# EAGLE design quantizer2_v30 (EAGLE 9.6.2)

## Sheet 1 of 2
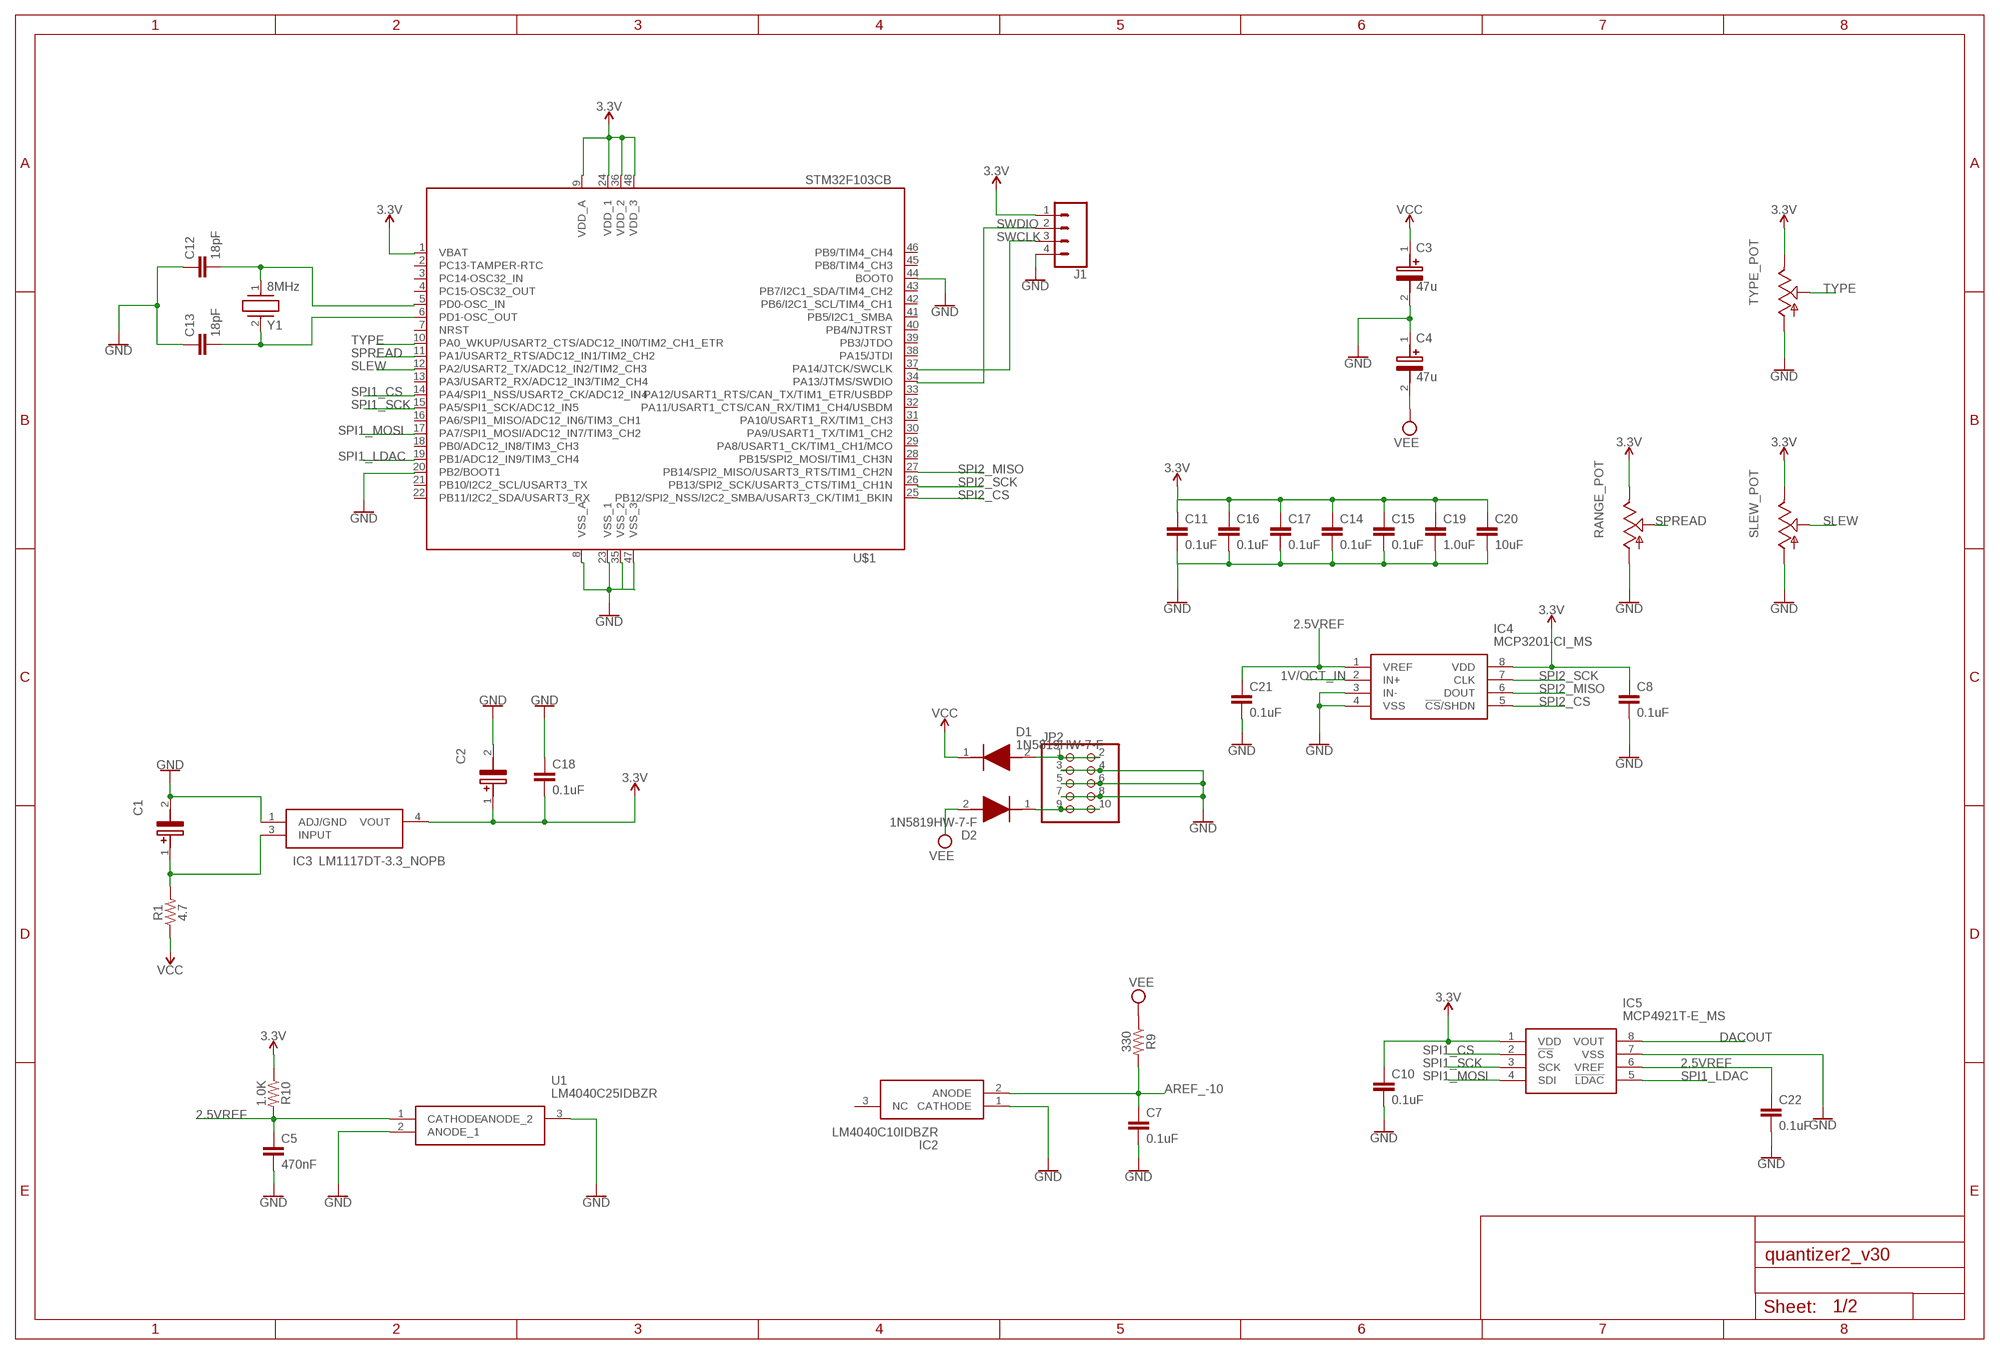
[diagram p0: schematic, sheet 1]

### Parts
C1  22uF  EEE-FP1E220AR  [EEE0GA101SR]
C2  22uF  EEE-FP1E220AR  [EEE0GA101SR]
C3  47u  EEE-FK1V470P  [EEE1AA101SP]
C4  47u  EEE-FK1V470P  [EEE1AA101SP]
C5  470nF  0.1UF-0603-25V-(+80/-20%)  [0603]
C7  0.1uF  0.1UF-0603-25V-(+80/-20%)  [0603]
C8  0.1uF  0.1UF-0603-25V-5%  [0603]
C10  0.1uF  0.1UF-0603-25V-5%  [0603]
C11  0.1uF  0.1UF-0603-25V-5%  [0603]
C12  18pF  18PF-0603-50V-5%  [0603]
C13  18pF  18PF-0603-50V-5%  [0603]
C14  0.1uF  0.1UF-0603-25V-5%  [0603]
C15  0.1uF  0.1UF-0603-25V-5%  [0603]
C16  0.1uF  0.1UF-0603-25V-(+80/-20%)  [0603]
C17  0.1uF  0.1UF-0603-25V-(+80/-20%)  [0603]
C18  0.1uF  0.1UF-0603-25V-(+80/-20%)  [0603]
C19  1.0uF  1.0UF-0603-16V-10%  [0603]
C20  10uF  10UF-0603-6.3V-20%  [0603]
C21  0.1uF  0.1UF-0603-25V-5%  [0603]
C22  0.1uF  0.1UF-0603-25V-5%  [0603]
D1  1N5819HW-7-F  [SOD3716X145N]
D2  1N5819HW-7-F  [SOD3716X145N]
IC2  LM4040C10IDBZR  [SOT95P237X112-3N]
IC3  LM1117DT-3.3_NOPB  [TO228P991X238-3N]
IC4  MCP3201-CI_MS  [SOP65P490X110-8N]
IC5  MCP4921T-E_MS  [SOP65P490X110-8N]
J1  CONN_04  [1X04]
JP2  PINHD-2X5  [2X05]
R1  4.7  RESISTOR1206  [1206]
R9  330  RESISTOR0603  [0603]
R10  1.0K  RESISTOR0603  [0603]
RANGE_POT  POT_USVERTICAL_PS  [ALPS_POT_VERTICAL_PS]
SLEW_POT  POTENTIOMETER-ALPHA-9MM_VERTICAL_  [POTENTIOMETER-ALPHA-9MM_VERTICAL]
TYPE_POT  POT_USVERTICAL_PS  [ALPS_POT_VERTICAL_PS]
U1  LM4040C25IDBZR  [SOT95P237X112-3N]
U$1  STM32F103CB  [LQFP48]
Y1  8MHz  ABLS3-8.000MHZ-D4Y-T  [ABLS]

### Nets
1V/OCT_IN: IC4.2(IN+) ; also sheet 2
2.5VREF: C5.1 C21.1 C22.1 IC4.1(VREF) IC5.6(VREF) R10.2 U1.1(CATHODE)
3.3V: C2.1(+) C8.1 C10.1 C11.1 C14.1 C15.1 C16.1 C17.1 C18.2 C19.1 C20.1 IC3.4(VOUT) IC4.8(VDD) IC5.1(VDD) J1.1 R10.1 RANGE_POT.P$1(E) SLEW_POT.3(E) TYPE_POT.P$1(E) U$1.1(VBAT) U$1.9(VDD_A) U$1.24(VDD_1) U$1.36(VDD_2) U$1.48(VDD_3)
AREF_-10: C7.1 IC2.2(ANODE) R9.2 ; also sheet 2
DACOUT: IC5.8(VOUT) ; also sheet 2
GND: C1.2(-) C2.2(-) C3.2(-) C4.1(+) C5.2 C7.2 C8.2 C10.2 C12.1 C13.1 C18.1 C21.2 C22.2 IC2.1(CATHODE) IC3.1(ADJ/GND) IC4.3(IN-) IC4.4(VSS) IC5.7(VSS) J1.4 JP2.3 JP2.4 JP2.5 JP2.6 JP2.7 JP2.8 RANGE_POT.P$3(A) SLEW_POT.1(A) TYPE_POT.P$3(A) U1.2(ANODE_1) U1.3(ANODE_2) U$1.8(VSS_A) U$1.20(PB2/BOOT1) U$1.23(VSS_1) U$1.35(VSS_2) U$1.44(BOOT0) U$1.47(VSS_3) ; also sheet 2
N$2: C1.1(+) IC3.3(INPUT) R1.2
N$4: D1.2(A) JP2.1 JP2.2
N$6: D2.1(K) JP2.9 JP2.10
N$10: C12.2 U$1.5(PD0-OSC_IN) Y1.1
N$11: C13.2 U$1.6(PD1-OSC_OUT) Y1.2
N$12: C11.2 C14.2 C15.2 C16.2 C17.2 C19.2 C20.2 ; supply symbol labelled GND
SLEW: SLEW_POT.2(S) U$1.12(PA2/USART2_TX/ADC12_IN2/TIM2_CH3)
SPI1_CS: IC5.2(!CS) U$1.14(PA4/SPI1_NSS/USART2_CK/ADC12_IN4)
SPI1_LDAC: IC5.5(!LDAC) U$1.19(PB1/ADC12_IN9/TIM3_CH4)
SPI1_MOSI: IC5.4(SDI) U$1.17(PA7/SPI1_MOSI/ADC12_IN7/TIM3_CH2)
SPI1_SCK: IC5.3(SCK) U$1.15(PA5/SPI1_SCK/ADC12_IN5)
SPI2_CS: IC4.5(!CS!/SHDN) U$1.25(PB12/SPI2_NSS/I2C2_SMBA/USART3_CK/TIM1_BKIN)
SPI2_MISO: IC4.6(DOUT) U$1.27(PB14/SPI2_MISO/USART3_RTS/TIM1_CH2N)
SPI2_SCK: IC4.7(CLK) U$1.26(PB13/SPI2_SCK/USART3_CTS/TIM1_CH1N)
SPREAD: RANGE_POT.P$2(S) U$1.11(PA1/USART2_RTS/ADC12_IN1/TIM2_CH2)
SWCLK: J1.3 U$1.37(PA14/JTCK/SWCLK)
SWDIO: J1.2 U$1.34(PA13/JTMS/SWDIO)
TYPE: TYPE_POT.P$2(S) U$1.10(PA0_WKUP/USART2_CTS/ADC12_IN0/TIM2_CH1_ETR)
VCC: C3.1(+) D1.1(K) R1.1 ; also sheet 2
VEE: C4.2(-) D2.2(A) R9.1 ; also sheet 2
Unconnected: IC2.3(NC) U$1.2(PC13-TAMPER-RTC) U$1.3(PC14-OSC32_IN) U$1.4(PC15-OSC32_OUT) U$1.7(NRST) U$1.13(PA3/USART2_RX/ADC12_IN3/TIM2_CH4) U$1.16(PA6/SPI1_MISO/ADC12_IN6/TIM3_CH1) U$1.18(PB0/ADC12_IN8/TIM3_CH3) U$1.21(PB10/I2C2_SCL/USART3_TX) U$1.22(PB11/I2C2_SDA/USART3_RX) U$1.28(PB15/SPI2_MOSI/TIM1_CH3N) U$1.29(PA8/USART1_CK/TIM1_CH1/MCO) U$1.30(PA9/USART1_TX/TIM1_CH2) U$1.31(PA10/USART1_RX/TIM1_CH3) U$1.32(PA11/USART1_CTS/CAN_RX/TIM1_CH4/USBDM) U$1.33(PA12/USART1_RTS/CAN_TX/TIM1_ETR/USBDP) U$1.38(PA15/JTDI) U$1.39(PB3/JTDO) U$1.40(PB4/NJTRST) U$1.41(PB5/I2C1_SMBA) U$1.42(PB6/I2C1_SCL/TIM4_CH1) U$1.43(PB7/I2C1_SDA/TIM4_CH2) U$1.45(PB8/TIM4_CH3) U$1.46(PB9/TIM4_CH4)

## Sheet 2 of 2
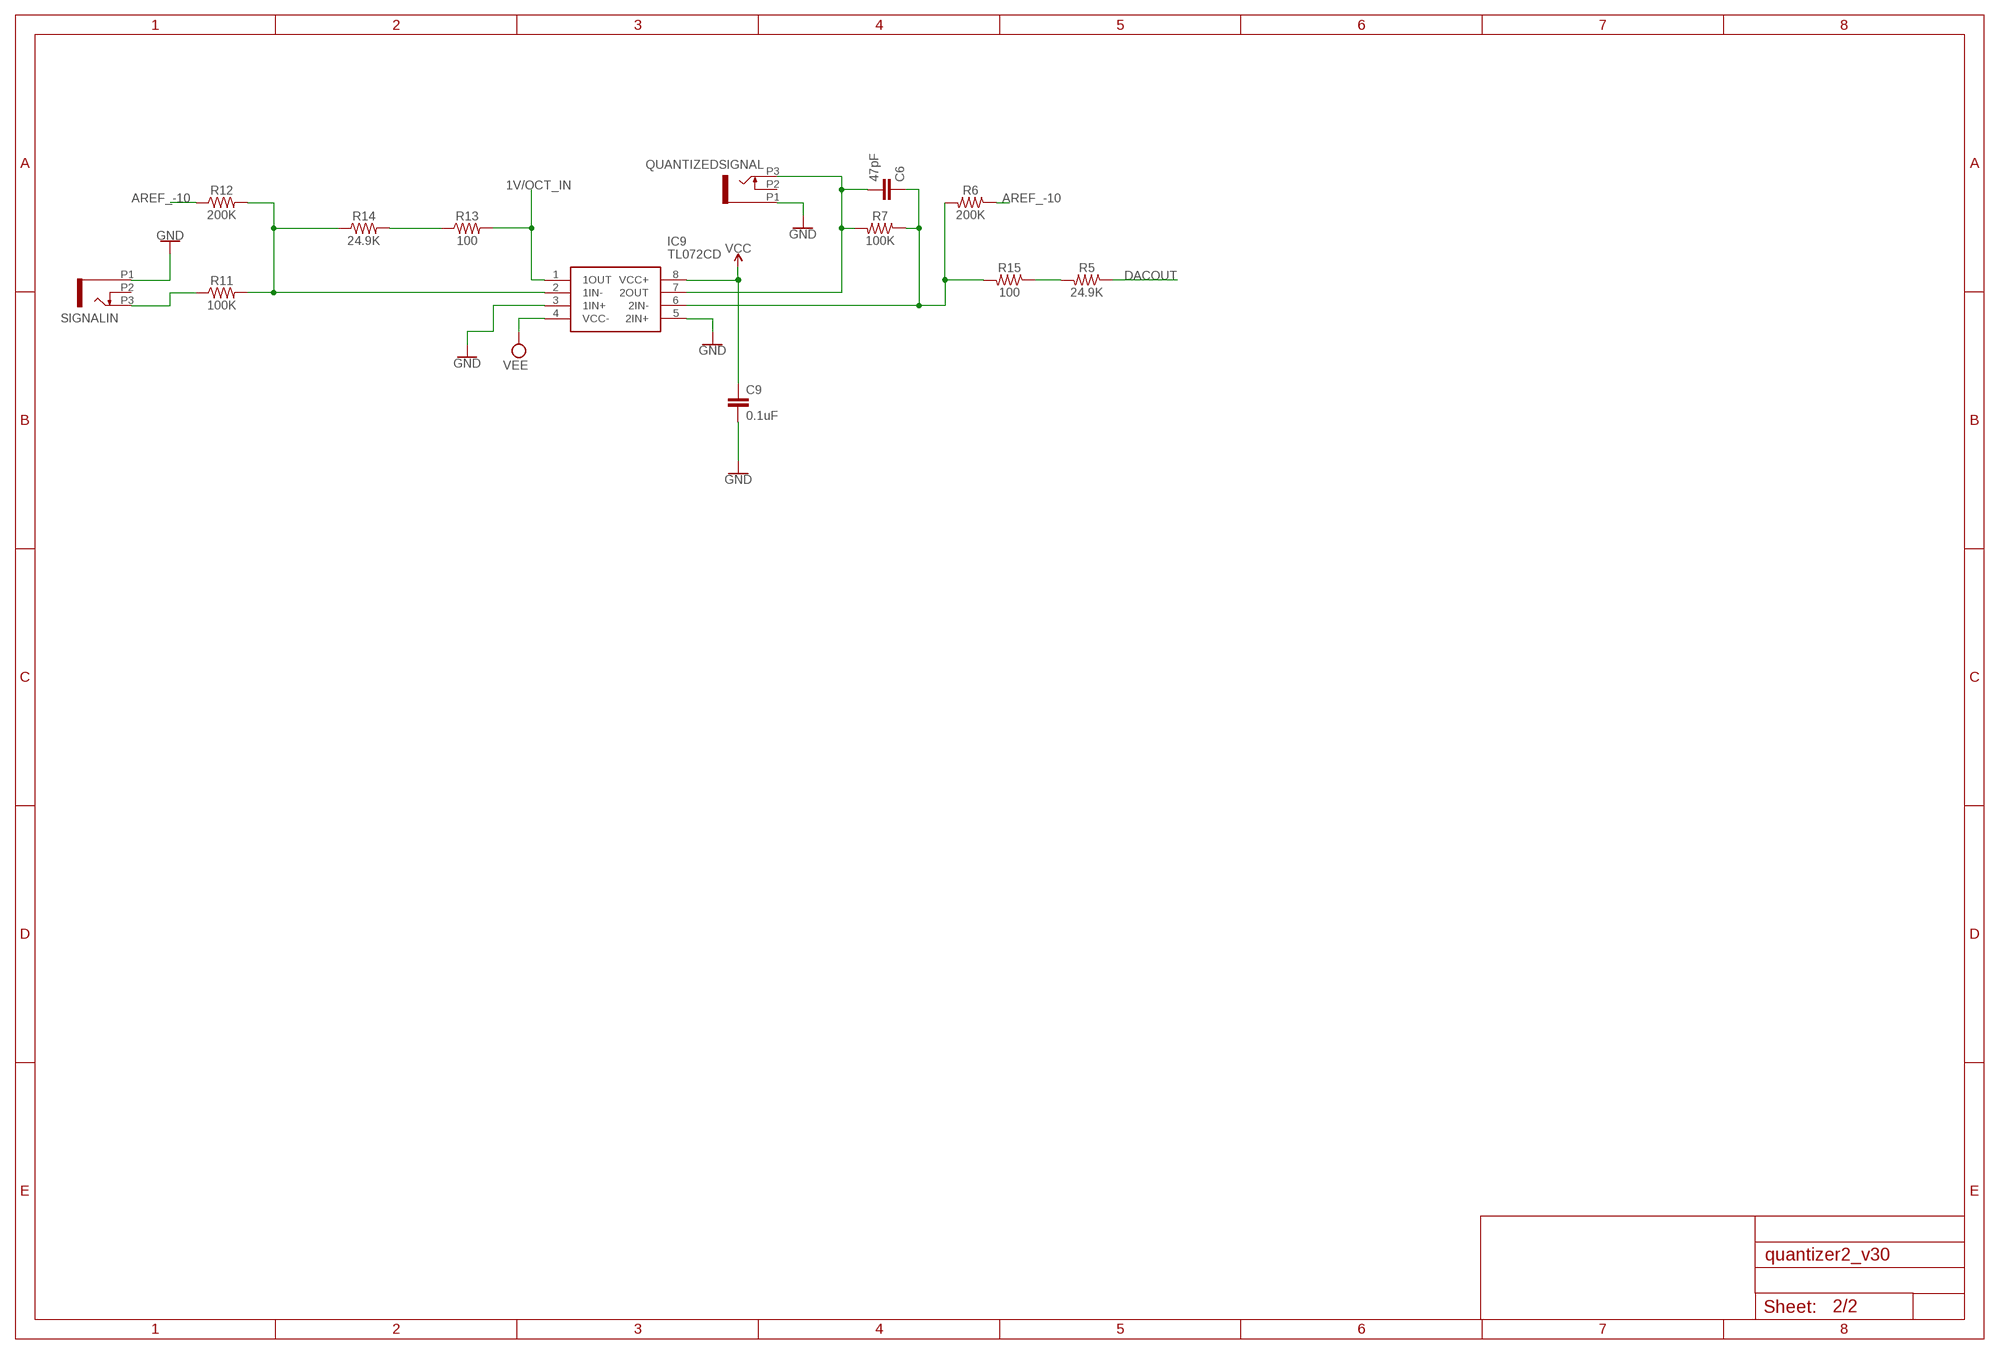
[diagram p1: schematic, sheet 2]

### Parts
C6  47pF  0.1UF-0603-25V-(+80/-20%)  [0603]
C9  0.1uF  0.1UF-0603-25V-(+80/-20%)  [0603]
IC9  TL072CD  [SOIC127P600X175-8N]
QUANTIZEDSIGNAL  PJ301_THONKICONN6  [WQP_PJ_301M6]
R5  24.9K  RESISTOR0603  [0603]
R6  200K  RESISTOR0603  [0603]
R7  100K  RESISTOR0603  [0603]
R11  100K  RESISTOR0603  [0603]
R12  200K  RESISTOR0603  [0603]
R13  100  RESISTOR0603  [0603]
R14  24.9K  RESISTOR0603  [0603]
R15  100  RESISTOR0603  [0603]
SIGNALIN  PJ301_THONKICONN6  [WQP_PJ_301M6]

### Nets
1V/OCT_IN: IC9.1(1OUT) R13.2 ; also sheet 1
AREF_-10: R6.1 R12.1 ; also sheet 1
DACOUT: R5.1 ; also sheet 1
GND: C9.2 IC9.3(1IN+) IC9.5(2IN+) QUANTIZEDSIGNAL.P1 SIGNALIN.P1 ; also sheet 1
N$5: R11.1 SIGNALIN.P3
N$8: IC9.2(1IN-) R11.2 R12.2 R14.1
N$13: C6.2 IC9.7(2OUT) QUANTIZEDSIGNAL.P3 R7.2
N$15: R13.1 R14.2
N$16: R5.2 R15.1
N$17: C6.1 IC9.6(2IN-) R6.2 R7.1 R15.2
VCC: C9.1 IC9.8(VCC+) ; also sheet 1
VEE: IC9.4(VCC-) ; also sheet 1
Unconnected: QUANTIZEDSIGNAL.P2 SIGNALIN.P2

## Library data of the parts
C1 C2 = EEE-FP1E220AR:EEE-FP1E220AR: PANASONIC - EEEFP1E220AR - SMD Aluminium Electrolytic Capacitor, Radial Can - SMD, 22 F, 25 V, 0.36 ohm, FP Series Source: Datasheet <http://industrial.panasonic.com/cdbs/www-data/pdf/RDE0000/ABA0000C1184.pdf>; DESCRIPTION: PANASONIC - EEEFP1E220AR - SMD Aluminium Electrolytic Capacitor, Radial Can - SMD, 22 F, 25 V, 0.36 ohm, FP Series; HEIGHT: 6.5mm; MANUFACTURER_NAME: Panasonic; MANUFACTURER_PART_NUMBER: EEE-FP1E220AR; MOUSER_PART_NUMBER: 667-EEE-FP1E220AR; MOUSER_PRICE-STOCK: https://www.mouser.co.uk/ProductDetail/Panasonic/EEE-FP1E220AR?qs=d1CqaRUMZD%252ByxlCLn0gmaw%3D%3D
C3 C4 = EEE-FK1V470P:EEE-FK1V470P: Aluminum Electrolytic Capacitors - SMD 47uF 35V Source: Datasheet <http://industrial.panasonic.com/cdbs/www-data/pdf/RDE0000/ABA0000C1181.pdf>; DESCRIPTION: Aluminum Electrolytic Capacitors - SMD 47uF 35V; HEIGHT: 7.8mm; MANUFACTURER_NAME: Panasonic; MANUFACTURER_PART_NUMBER: EEE-FK1V470P; MOUSER_PART_NUMBER: 667-EEE-FK1V470P; MOUSER_PRICE-STOCK: https://www.mouser.co.uk/ProductDetail/Panasonic/EEE-FK1V470P?qs=qE6bgDGEOCuVUX5CkiabHQ%3D%3D
C5 C6 = SparkFun-Capacitors:0.1UF: 0.1µF ceramic capacitors A capacitor is a passive two-terminal electrical component used to store electrical energy temporarily in an electric field.; PROD_ID: CAP-00810; VALUE: 0.1uF
C7 C9 C16-C18 = SparkFun-Capacitors:0.1UF: 0.1µF ceramic capacitors A capacitor is a passive two-terminal electrical component used to store electrical energy temporarily in an electric field.; PROD_ID: CAP-00810
C8 C10 C11 C14 C15 C21 C22 = SparkFun-Capacitors:0.1UF: 0.1µF ceramic capacitors A capacitor is a passive two-terminal electrical component used to store electrical energy temporarily in an electric field.; PROD_ID: CAP-08604
C12 C13 = SparkFun-Capacitors:18PF: 18pF ceramic capacitors A capacitor is a passive two-terminal electrical component used to store electrical energy temporarily in an electric field.; PROD_ID: CAP-08267
C19 = SparkFun-Capacitors:1.0UF: 1µF ceramic capacitors A capacitor is a passive two-terminal electrical component used to store electrical energy temporarily in an electric field.; PROD_ID: CAP-00868
C20 = SparkFun-Capacitors:10UF: 10.0µF ceramic capacitors A capacitor is a passive two-terminal electrical component used to store electrical energy temporarily in an electric field.; PROD_ID: CAP-11015
D1 D2 = 1N5819HW-7-F:1N5819HW-7-F: Diode Schottky 1A 40V SOD123 Diodes Inc 1N5819HW-7-F, SMT Schottky Diode, 40V 1A, 2-Pin SOD-123 Source: Datasheet <https://datasheet.datasheetarchive.com/originals/distributors/Datasheets-DGA23/1390892.pdf>; DESCRIPTION: Diode Schottky 1A 40V SOD123 Diodes Inc 1N5819HW-7-F, SMT Schottky Diode, 40V 1A, 2-Pin SOD-123; HEIGHT: 1.45mm; MANUFACTURER_NAME: Diodes Inc.; MANUFACTURER_PART_NUMBER: 1N5819HW-7-F; MOUSER_PART_NUMBER: 621-1N5819HW-F; MOUSER_PRICE-STOCK: https://www.mouser.co.uk/ProductDetail/Diodes-Incorporated/1N5819HW-7-F?qs=NQ47qNm99eDyWTEd07miYA%3D%3D
IC2 = LM4040C10IDBZR:LM4040C10IDBZR: PRECISION MICROPOWER SHUNT VOLTAGE REFERENCE Source: Datasheet <http://www.ti.com/lit/gpn/lm4040>; DESCRIPTION: PRECISION MICROPOWER SHUNT VOLTAGE REFERENCE; HEIGHT: mm; MANUFACTURER_NAME: Texas Instruments; MANUFACTURER_PART_NUMBER: LM4040C10IDBZR; MOUSER_PART_NUMBER: 595-LM4040C10IDBZR; MOUSER_PRICE-STOCK: https://www.mouser.com/Search/Refine.aspx?Keyword=595-LM4040C10IDBZR
IC3 = LM1117DT-3.3_NOPB:LM1117DT-3.3_NOPB: Space saving 800-mA low-dropout linear regulator with internal current limit Source: Datasheet <https://datasheet.datasheetarchive.com/originals/distributors/Datasheets-SFU2/DSASFU100036103.pdf>; DESCRIPTION: Space saving 800-mA low-dropout linear regulator with internal current limit; HEIGHT: 2.38mm; MANUFACTURER_NAME: Texas Instruments; MANUFACTURER_PART_NUMBER: LM1117DT-3.3/NOPB; MOUSER_PART_NUMBER: 926-LM1117DT-3.3NOPB; MOUSER_PRICE-STOCK: https://www.mouser.co.uk/ProductDetail/Texas-Instruments/LM1117DT-3.3-NOPB?qs=X1J7HmVL2ZHOT670myqy2w%3D%3D
IC4 = MCP3201-CI_MS:MCP3201-CI_MS: Analog to Digital Converters - ADC 12-bit SPI Sgl Chl Source: Datasheet <http://www.microchip.com/mymicrochip/filehandler.aspx?ddocname=en011279>; DESCRIPTION: Analog to Digital Converters - ADC 12-bit SPI Sgl Chl; HEIGHT: 1.1mm; MANUFACTURER_NAME: Microchip; MANUFACTURER_PART_NUMBER: MCP3201-CI/MS; MOUSER_PART_NUMBER: 579-MCP3201-CI/MS; MOUSER_PRICE-STOCK: https://www.mouser.co.uk/ProductDetail/Microchip-Technology-Atmel/MCP3201-CI-MS?qs=mcPJWgAPNrdThuaOU%2FBAFA%3D%3D
IC5 = MCP4921T-E_MS:MCP4921T-E_MS: Digital to Analog Converters - DAC Sgl 12-bit SPI int Source: Datasheet <http://www.microchip.com/mymicrochip/filehandler.aspx?ddocname=en547911>; DESCRIPTION: Digital to Analog Converters - DAC Sgl 12-bit SPI int; HEIGHT: 1.1mm; MANUFACTURER_NAME: Microchip; MANUFACTURER_PART_NUMBER: MCP4921T-E/MS; MOUSER_PART_NUMBER: 579-MCP4921T-E/MS; MOUSER_PRICE-STOCK: https://www.mouser.co.uk/ProductDetail/Microchip-Technology/MCP4921T-E-MS?qs=fM4xO01eazMZI7WjXZqD2A%3D%3D
IC9 = TL072CD:TL072CD: Dual Low-Noise JFET-Input General-Purpose Operational Amplifier Source: Datasheet <http://www.ti.com/lit/ds/symlink/tl072.pdf>; DESCRIPTION: Dual Low-Noise JFET-Input General-Purpose Operational Amplifier; HEIGHT: 1.75mm; MANUFACTURER_NAME: Texas Instruments; MANUFACTURER_PART_NUMBER: TL072CD; MOUSER_PART_NUMBER: 595-TL072CD; MOUSER_PRICE-STOCK: https://www.mouser.co.uk/ProductDetail/Texas-Instruments/TL072CD?qs=5nGYs9Do7G0niDPig1J2Tw%3D%3D
J1 = SparkFun-Connectors:CONN_04: Multi connection point. Often used as Generic Header-pin footprint for 0.1 inch spaced/style header connections On any of the 0.1 inch spaced packages, you can populate with these: Break Away Headers - Straight <https://www.sparkfun.com/products/116> (PRT-00116) Break Away Male Headers - Right Angle <https://www.sparkfun.com/products/553> (PRT-00553) Female Headers <https://www.sparkfun.com/products/115> (PRT-00115) Break Away Headers - Machine Pin <https://www.sparkfun.com/products/117> (PRT-00117) Break Away Female Headers - Swiss Machine Pin <https://www.sparkfun.com/products/743> (PRT-00743) For SCREWTERMINALS and SPRING TERMINALS visit here: Screw Terimnals on SparkFun.com <https://www.sparkfun.com/search/results?term=Screw+Terminals> (5mm/3.5mm/2.54mm spacing) This device is also useful as a general connection point to wire up your design to another part of your project. Our various solder wires solder well into these plated through hole pads. Hook-Up Wire - Assortment (Stranded, 22 AWG) <https://www.sparkfun.com/products/11375> (PRT-11375) Hook-Up Wire - Assortment (Solid Core, 22 AWG) <https://www.sparkfun.com/products/11367> (PRT-11367) View the entire wire category on our website here <https://www.sparkfun.com/categories/141> Special notes: Molex polarized connector foot print use with SKU : PRT-08231 with associated crimp pins and housings. 1MM SMD Version SKU: PRT-10208; PROD_ID: CONN-09696
JP2 = pinhead:PINHD-2X5: PIN HEADER
QUANTIZEDSIGNAL SIGNALIN = og-pj301_variations:PJ301_THONKICONN
R1 R5-R7 R9-R15 = SparkFun-Resistors:RESISTOR: Generic Resistor Package
RANGE_POT TYPE_POT = og-pots:POT_US
SLEW_POT = EURACK-MASTER-LIB:POTENTIOMETER-ALPHA-9MM_VERTICAL: 9mm vertical snap-in pot, Alpha / Panasonic style
U1 = LM4040C25IDBZR:LM4040C25IDBZR: TEXAS INSTRUMENTS - LM4040C25IDBZR - VOLTAGE REF, SHUNT, 2.5V, SOT-23-3 Source: Datasheet <https://datasheet.datasheetarchive.com/originals/distributors/Datasheets-DGA16/867624.pdf>; DESCRIPTION: TEXAS INSTRUMENTS - LM4040C25IDBZR - VOLTAGE REF, SHUNT, 2.5V, SOT-23-3; HEIGHT: 1.12mm; MANUFACTURER_NAME: Texas Instruments; MANUFACTURER_PART_NUMBER: LM4040C25IDBZR; MOUSER_PART_NUMBER: 595-LM4040C25IDBZR; MOUSER_PRICE-STOCK: https://www.mouser.co.uk/ProductDetail/Texas-Instruments/LM4040C25IDBZR?qs=VBduBm9rCJStNYDGENjZXg%3D%3D
U$1 = stm32:STM32F103CB
Y1 = ABLS3-8.000MHZ-D4Y-T:ABLS3-8.000MHZ-D4Y-T: HC49/US (AT49) LOW PROFILE SMD MICROPROCESSOR CRYSTAL Source: Datasheet <https://abracon.com/Resonators/abls.pdf>; DESCRIPTION: HC49/US (AT49) LOW PROFILE SMD MICROPROCESSOR CRYSTAL; HEIGHT: mm; MANUFACTURER_NAME: ABRACON; MANUFACTURER_PART_NUMBER: ABLS3-8.000MHZ-D4Y-T; MOUSER_PART_NUMBER: 815-ABLS3-8MD4YT; MOUSER_PRICE-STOCK: https://www.mouser.co.uk/ProductDetail/ABRACON/ABLS3-8000MHZ-D4Y-T?qs=WRzgYYgs9gC3im7pazpFGA%3D%3D

## Board
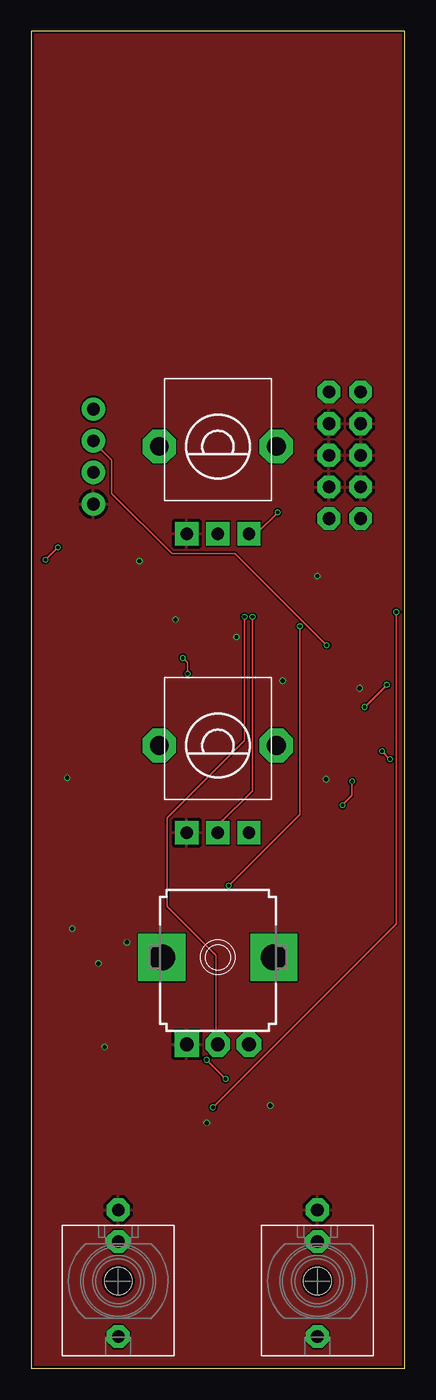
[diagram p2: board, top side]
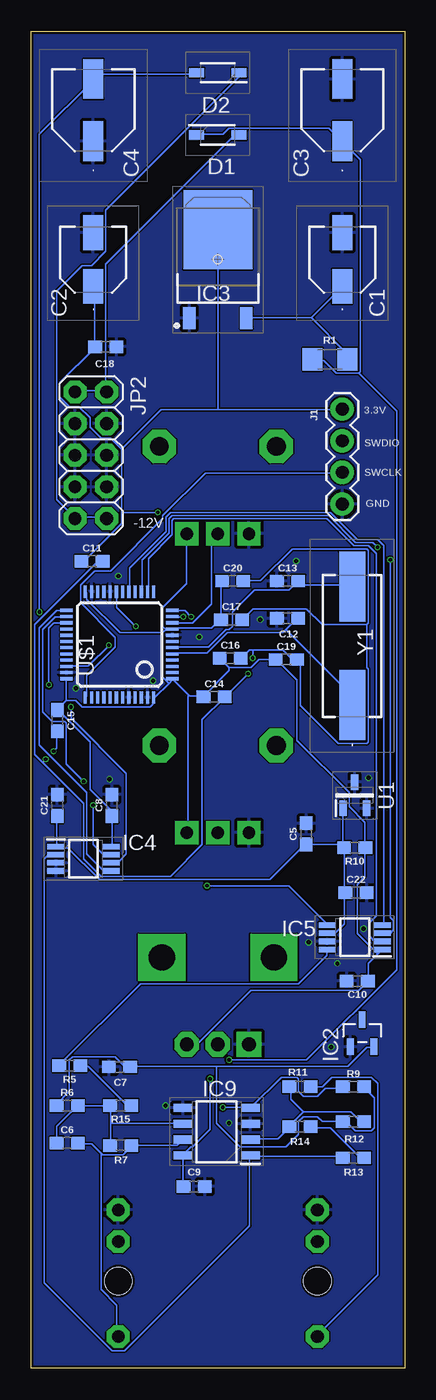
[diagram p3: board, bottom side, seen from below]

Size 30 x 107.34 mm. Coordinates in mm from the lower left corner, seen from the top.
Outline: 0,0 30,0 30,107.34 0,107.34 0,0
Copper layers (1*16): Top 0.035mm / dielectric 1.6mm / Bottom 0.035mm
Design rules "jlcpcb-2layers": minimum track width 5mil, minimum drill 0.3mm, track to track 5mil, track to pad 5mil, pad to pad 5mil, via to via 5mil, smd to smd 5mil, copper to edge 0.2mm, drill to drill 6mil, minimum pad ring 10mil, minimum via ring 3mil, stop-mask expansion 4mil, vias tented up to drill 0mil, thermal gap 10mil

### Footprints (pad centres in the part's own frame; a part is rotated, then mirrored left to right if it is on the bottom)
EEE0GA101SR = smd 2.8 x 1.6: 1 -2.15,0; 2 2.15,0
EEE1AA101SP = smd 3.2 x 1.6: 1 -2.5,0; 2 2.5,0
0603 = smd 1.1 x 1: 1 -0.85,0; 2 0.85,0
SOD3716X145N = smd 1.2 x 0.75: 1 -1.7,0; 2 1.7,0
SOT95P237X112-3N = smd 1.321 x 0.559: 1 -1.092,0.94; 2 -1.092,-0.94 | smd 1.321 x 0.508: 3 1.092,0
TO228P991X238-3N = smd 1.75 x 1: 1 -4.7,2.285; 3 -4.7,-2.285 | smd 6.35 x 5.55: 4 2.4,0
SOP65P490X110-8N = smd 1.4 x 0.45: 1 -2.2,0.975; 2 -2.2,0.325; 3 -2.2,-0.325; 4 -2.2,-0.975; 5 2.2,-0.975; 6 2.2,-0.325; 7 2.2,0.325; 8 2.2,0.975
SOIC127P600X175-8N = smd 1.528 x 0.65: 1 -2.711,1.905; 2 -2.711,0.635; 3 -2.711,-0.635; 4 -2.711,-1.905; 5 2.711,-1.905; 6 2.711,-0.635; 7 2.711,0.635; 8 2.711,1.905
1X04 = drill 1.016 pad 1.88: 1 0,0; 2 2.54,0; 3 5.08,0; 4 7.62,0
2X05 = drill 1.016 octagon: 1 -5.08,-1.27; 2 -5.08,1.27; 3 -2.54,-1.27; 4 -2.54,1.27; 5 0,-1.27; 6 0,1.27; 7 2.54,-1.27; 8 2.54,1.27; 9 5.08,-1.27; 10 5.08,1.27
WQP_PJ_301M6 = drill 1.016 pad 1.778 octagon: P1 0,-5.715; P2 0,-3.175; P3 0,4.445 | hole 2.2: 0,0
1206 = smd 1.6 x 1.8: 1 -1.4,0; 2 1.4,0
ALPS_POT_VERTICAL_PS = drill 1 pad 1.88 square: P$1 -2.5,7; P$2 0,7; P$3 2.5,7 | drill 1.5 pad 2.54 octagon: P$4 -4.7,0; P$5 4.7,0
POTENTIOMETER-ALPHA-9MM_VERTICAL = drill 1.1 pad 1.676 square: 1 -2.5,-7 | drill 1.1 pad 1.676 octagon: 2 0,-7; 3 2.5,-7 | drill 2.1 pad 2.8 square: M1 4.5,0; M2 -4.5,0
SOT95P237X112-3N' = smd 1.25 x 0.6: 1 -1.05,0.95; 2 -1.05,-0.95; 3 1.05,0
LQFP48 = smd 0.254 x 1: 1 -2.75,-4.25; 2 -2.25,-4.25; 3 -1.75,-4.25; 4 -1.25,-4.25; 5 -0.75,-4.25; 6 -0.25,-4.25; 7 0.25,-4.25; 8 0.75,-4.25; 9 1.25,-4.25; 10 1.75,-4.25; 11 2.25,-4.25; 12 2.75,-4.25; 25 2.75,4.25; 26 2.25,4.25; 27 1.75,4.25; 28 1.25,4.25; 29 0.75,4.25; 30 0.25,4.25; 31 -0.25,4.25; 32 -0.75,4.25; 33 -1.25,4.25; 34 -1.75,4.25; 35 -2.25,4.25; 36 -2.75,4.25 | smd 1 x 0.254: 13 4.25,-2.75; 14 4.25,-2.25; 15 4.25,-1.75; 16 4.25,-1.25; 17 4.25,-0.75; 18 4.25,-0.25; 19 4.25,0.25; 20 4.25,0.75; 21 4.25,1.25; 22 4.25,1.75; 23 4.25,2.25; 24 4.25,2.75; 37 -4.25,2.75; 38 -4.25,2.25; 39 -4.25,1.75; 40 -4.25,1.25; 41 -4.25,0.75; 42 -4.25,0.25; 43 -4.25,-0.25; 44 -4.25,-0.75; 45 -4.25,-1.25; 46 -4.25,-1.75; 47 -4.25,-2.25; 48 -4.25,-2.75
ABLS = smd 5.6 x 2.1: 1 -4.75,0; 2 4.75,0

### Placement (x,y rotation side)
C1  5,89 90 bottom
C2  25,89 90 bottom
C3  5,101 90 bottom
C4  25,101 90 bottom
C5  7.9,42.9 90 bottom
C6  27.1,18.1 0 bottom
C7  22.9,24.2 180 bottom
C8  23.5,45.2 90 bottom
C9  16.9,14.6 0 bottom
C10  3.8,31.1 180 bottom
C11  25.1,64.8 0 bottom
C12  9.4,60.2 0 bottom
C13  9.4,63.2 0 bottom
C14  15.3,53.9 0 bottom
C15  27.9,52 270 bottom
C16  14,57 0 bottom
C17  13.9,60.1 0 bottom
C18  24,82 180 bottom
C19  9.5,56.9 0 bottom
C20  13.8,63.2 0 bottom
C21  27.9,45.2 90 bottom
C22  3.9,38.2 0 bottom
D1  15,99 0 bottom
D2  15,104 180 bottom
IC2  3.4,26.9 90 bottom
IC3  15,89 90 bottom
IC4  25.8,40.9 0 bottom
IC5  4,34.6 180 bottom
IC9  15.1,19 180 bottom
J1  5,77 270 bottom
JP2  25.2,73.3 270 bottom
QUANTIZEDSIGNAL  23,7 180 top
R1  6,81 0 bottom
R5  26.9,24.3 0 bottom
R6  27.1,21.1 0 bottom
R7  22.8,17.9 0 bottom
R9  4.1,22.6 0 bottom
R10  4,41.8 180 bottom
R11  8.4,22.6 180 bottom
R12  4.1,19.8 0 bottom
R13  4.1,16.9 180 bottom
R14  8.4,19.4 0 bottom
R15  22.8,21.1 180 bottom
RANGE_POT  15,50 180 top
SIGNALIN  7,7 180 top
SLEW_POT  15,33 0 top
TYPE_POT  15,74 180 top
U1  LM4040C25IDBZR  [SOT95P237X112-3N']  4,46 90 bottom
U$1  22.9,58.1 90 bottom
Y1  4.2,58 90 bottom

### Tracks (layer width: path | path; a pad name or v marks a point on that pad's centre or on a via)
1V/OCT_IN
  Bottom 0.127: R13.2 4.95,17.02 12.32,17.02 IC9.1 12.45,17.02 12.45,11.43 22.48,1.4 23.5,1.4 28.96,6.86 28.96,40.89 28.7,41.15 28.07,41.15 IC4.2
2.5VREF
  Bottom 0.127: C21.1 27.94,44.32 27.94,41.91 IC4.1 27.94,41.78 27.05,41.78 24.51,39.24 10.79,39.24 8,42.04 C5.1 7.87,42.04 5.08,42.04 4.95,41.91 | 4.95,41.91 4.95,44.83 U1.1 | 4.95,41.91 R10.2 4.83,41.78 4.83,38.23 C22.1 4.83,38.1 4.83,35.69 5.59,34.92 IC5.6
3.3V  (via drill 0.3)
  Top 0.127: v19.81,68.71 18.16,67.06 17.53,67.06 TYPE_POT.P$1
  Bottom 0.127: C2.1 24.89,86.74 24.89,82.04 C18.2 24.89,81.92 27.69,79.12 27.69,77.98 26.92,77.22 26.16,77.22 25.27,76.33 25.27,75.56 24.38,74.68 23.62,74.68 22.73,73.79 | 22.73,73.79 22.73,68.71 | 22.73,68.71 22.73,67.82 25.65,64.9 25.91,64.9 C11.1 | 14.99,76.96 19.56,76.96 22.73,73.79 | 14.99,76.96 5.08,76.96 J1.1 | 14.99,76.96 14.99,91.31 IC3.4 | 2.16,33.27 1.91,33.53 IC5.1 | 2.16,33.27 2.92,32.51 2.92,31.11 C10.1 3.05,30.99 3.68,30.35 12.32,30.35 16.64,26.04 17.4,26.04 SLEW_POT.3 | 2.16,33.27 3.81,34.92 3.81,38.86 3.17,39.5 3.17,41.78 R10.1 3.17,41.91 3.17,43.81 4.45,45.09 4.45,46.23 8.64,50.42 8.64,55.24 10.29,56.9 C19.1 10.41,56.9 11.68,56.9 12.32,56.26 14.1,56.26 | 19.43,59.05 22.86,59.05 25.53,61.72 25.53,62.23 U$1.24 | 19.18,59.31 19.43,59.05 | 19.18,59.31 18.67,59.31 U$1.9 18.54,59.44 15.49,59.44 14.86,60.07 C17.1 14.73,60.2 14.73,63.12 C20.1 | 19.18,59.31 19.43,59.56 19.43,61.09 17.53,62.99 17.53,66.93 TYPE_POT.P$1 | 14.1,56.26 14.73,56.9 C16.1 | IC4.8 23.5,41.91 23.5,44.32 C8.1 23.62,44.45 23.62,44.83 25.27,46.48 25.27,50.29 27.81,52.83 C15.1 27.81,52.96 27.18,53.59 | 27.18,53.59 27.18,55.24 U$1.36 | 18.92,54.99 20.07,53.85 U$1.48 20.19,53.85 20.19,53.34 20.45,53.09 25.91,53.09 26.42,53.59 27.18,53.59 | 18.92,54.99 18.67,55.24 U$1.1 18.54,55.24 17.4,54.1 | 17.4,54.1 17.27,53.98 16.26,53.98 C14.1 16.13,53.98 14.1,56.01 14.1,56.26 | 17.4,54.1 17.4,43.05 RANGE_POT.P$1 | 19.43,59.05 19.43,55.5 18.92,54.99 | v19.81,68.71 22.73,68.71
AREF_-10
  Bottom 0.127: R9.2 3.17,22.48 2.41,21.72 2.41,19.3 2.67,19.05 3.94,19.05 4.57,19.68 4.83,19.68 R12.1 4.95,19.81 6.6,19.81 6.99,20.19 8.13,20.19 8.51,19.81 8.51,18.8 9.53,17.78 13.21,17.78 15.11,19.68 15.11,24.26 | R6.1 27.94,21.21 26.92,22.23 26.92,24.77 26.67,25.02 23.24,25.02 22.48,24.26 22.1,24.26 C7.1 21.97,24.26 15.11,24.26 | 15.11,24.26 4.57,24.26 3.05,25.78 2.54,25.78 IC2.2
DACOUT
  Bottom 0.127: R5.1 27.69,24.38 21.21,30.86 8.51,30.86 6.22,33.15 6.22,33.53 IC5.8
GND  (via drill 0.35)
  other vias: 16.5,58.7 23,63.6 20.2,55.2 26.4,54.6 8.7,64.8 11.6,60.1 23.7,47.3 2.9,47.4 5.9,25.8 5.4,32.5 7.7,34.2 3.3,35.3 14.1,19.7 19.2,21.1
  pour Top: 0,107.3 30,107.3 30,0 0,0
  pour Bottom: 0,107.3 30,107.3 30,0 0,0
N$2
  Bottom 0.127: 7.49,84.33 12.7,84.33 IC3.3 | 7.49,84.33 5.08,86.74 C1.1 | 7.49,84.33 4.7,81.53 4.7,81.03 R1.2
N$4
  Bottom 0.127: 24,78.49 24,88.65 13.72,98.93 13.34,98.93 D1.2 | 24,78.49 26.42,78.49 JP2.1 | 24,78.49 JP2.2
N$5
  Bottom 0.127: R11.1 7.49,22.61 6.6,22.61 5.84,23.37 2.67,23.37 2.16,22.86 2.16,7.49 6.99,2.67 SIGNALIN.P3
N$6
  Bottom 0.127: D2.1 13.34,103.89 13.34,103.63 24,92.96 24,89.66 25.15,88.52 25.91,88.52 27.94,86.49 27.94,69.72 26.54,68.33 JP2.9 26.42,68.33 24,68.33 JP2.10
N$8
  Bottom 0.127: 8.13,20.57 4.32,20.57 3.56,19.81 3.3,19.81 R12.2 | 8.13,20.57 9.27,19.43 R14.1 9.27,19.3 10.16,18.41 12.32,18.41 IC9.2 | 8.13,20.57 9.14,21.59 9.14,22.48 R11.2
N$10
  Bottom 0.127: 9.53,59.31 8.64,60.2 C12.2 | 9.53,59.31 9.78,59.05 14.22,59.05 15.88,57.4 18.54,57.4 U$1.5 | 9.53,59.31 4.32,54.1 4.32,53.34 Y1.1
N$11
  Bottom 0.127: U$1.6 18.54,57.91 15.75,57.91 14.35,59.31 14.1,59.31 13.84,59.56 13.84,60.71 12.06,62.48 9.27,62.48 8.64,63.12 C13.2 8.51,63.12 8.26,62.87 4.32,62.87 Y1.2
N$12  (via drill 0.3)
  Top 0.127: v12.57,55.75 12.57,56.64 v12.19,57.02 | v28.83,48.9 v28.19,49.53
  Bottom 0.127: 3.05,59.69 2.92,59.82 2.92,65.66 3.05,65.79 9.02,65.79 11.56,63.25 12.83,63.25 C20.2 | 3.05,59.69 6.6,59.69 7.87,60.96 12.19,60.96 12.95,60.2 C17.2 | 12.19,57.66 12.45,57.66 13.08,57.02 C16.2 | 12.19,57.66 9.78,57.66 9.14,57.02 8.76,57.02 C19.2 8.64,56.9 8.38,56.64 8.38,53.21 5.33,50.16 3.05,50.16 2.92,50.29 2.92,56.13 3.05,56.26 3.05,59.69 | v12.57,55.75 14.35,53.98 C14.2 14.48,53.85 16.26,52.07 16.26,42.04 18.8,39.5 24.38,39.5 25.78,40.89 25.78,45.34 29.08,48.64 | 12.19,57.66 v12.19,57.02 | 29.08,48.64 29.72,49.28 29.72,59.69 24.64,64.77 24.26,64.77 C11.2 | v28.19,49.53 27.94,49.78 27.94,51.05 C15.2 | 29.08,48.64 v28.83,48.9
N$13
  Bottom 0.127: IC9.7 17.91,18.29 18.29,17.91 21.84,17.91 R7.2 21.97,17.78 22.61,17.14 24.26,17.14 24.38,17.27 | 24.38,17.27 25.15,18.03 26.16,18.03 C6.2 | 24.38,17.27 24.38,6.35 23.11,5.08 23.11,2.67 QUANTIZEDSIGNAL.P3
N$15
  Bottom 0.127: R13.1 3.3,17.02 3.68,17.02 5.97,19.3 7.49,19.3 R14.2
N$16
  Bottom 0.127: R15.1 21.97,21.21 22.35,21.21 25.4,24.26 26.04,24.26 R5.2
N$17
  Bottom 0.127: 23.62,19.68 23.62,21.08 R15.2 23.75,21.08 26.16,21.08 R6.2 26.29,21.08 27.94,19.43 27.94,18.16 C6.1 | 23.62,19.68 23.62,17.91 R7.1 | 23.62,19.68 17.91,19.68 IC9.6
SLEW  (via drill 0.3)
  Top 0.127: v17.14,60.33 17.14,50.42 10.92,44.2 10.92,37.08 14.86,33.15 14.86,26.16 14.99,26.04 SLEW_POT.2
  Bottom 0.127: v17.14,60.33 17.65,60.83 18.54,60.83 U$1.12
SPI1_CS
  Bottom 0.127: U$1.14 20.57,62.36 20.57,65.02 18.67,66.93 18.67,68.07 18.54,68.2 6.22,68.2 4.06,66.04 2.92,66.04 2.29,65.41 2.29,36.32 2.79,35.81 2.79,34.67 2.41,34.29 1.91,34.29 IC5.2
SPI1_LDAC  (via drill 0.3)
  Top 0.127: v21.59,59.56 21.59,44.45 v15.88,38.73
  Bottom 0.127: v21.59,59.56 23.11,61.09 23.11,62.23 U$1.19 | v15.88,38.73 9.27,38.73 6.22,35.69 IC5.5
SPI1_MOSI
  Bottom 0.127: U$1.17 22.1,62.36 22.1,64.26 19.18,67.18 19.18,68.33 18.8,68.71 5.97,68.71 3.81,66.55 2.16,66.55 1.65,66.04 1.65,35.81 1.78,35.69 IC5.4
SPI1_SCK  (via drill 0.3)
  Top 0.127: v1.14,64.9 v2.16,65.91
  Bottom 0.127: v2.16,65.91 2.54,66.29 3.94,66.29 6.1,68.45 18.67,68.45 18.92,68.2 18.92,67.06 21.08,64.9 21.08,62.36 U$1.15 | v1.14,64.9 1.14,36.2 0.89,35.94 0.89,35.18 1.14,34.92 IC5.3
SPI2_CS
  Bottom 0.127: U$1.25 27.18,60.83 27.94,60.83 29.34,59.44 29.34,50.04 25.53,46.23 25.53,41.27 24.26,40.01 23.62,40.01 IC4.5
SPI2_MISO  (via drill 0.3)
  Top 0.127: v26.8,53.09 v28.57,54.86
  Bottom 0.127: v28.57,54.86 28.57,59.44 28.19,59.82 27.18,59.82 U$1.27 | v26.8,53.09 26.8,52.2 22.35,47.75 22.35,41.27 22.99,40.64 23.5,40.64 IC4.6
SPI2_SCK  (via drill 0.3)
  Top 0.127: v25.78,47.12 25.78,45.97 v25.02,45.21
  Bottom 0.127: v25.78,47.12 27.18,48.51 27.18,51.82 27.3,51.94 28.32,51.94 29.08,52.7 29.08,59.31 28.07,60.33 27.18,60.33 U$1.26 | v25.02,45.21 25.02,42.04 24.26,41.27 23.62,41.27 IC4.7
SPREAD  (via drill 0.3)
  Top 0.127: v17.78,60.33 17.78,46.35 15.11,43.69 15.11,43.05 RANGE_POT.P$2
  Bottom 0.127: v17.78,60.33 18.54,60.33 U$1.11
SWCLK
  Bottom 0.127: U$1.37 25.53,53.98 25.53,55.63 23.24,57.91 23.24,58.67 26.04,61.47 26.04,62.87 24.89,64.01 23.62,64.01 19.43,68.2 19.43,68.45 16,71.88 5.08,71.88 J1.3
SWDIO  (via drill 0.3)
  Top 0.127: v23.75,58.04 16.38,65.41 11.3,65.41 6.48,70.23 6.48,72.9 4.95,74.42 J1.2
  Bottom 0.127: v23.75,58.04 25.4,56.39 27.05,56.39 U$1.34
TYPE
  Bottom 0.127: U$1.10 18.54,59.82 17.02,59.82 15.49,61.34 15.49,66.55 15.11,66.93 TYPE_POT.P$2
VCC  (via drill 0.3)
  Top 0.127: v14.1,24.77 v15.62,23.24
  Bottom 0.127: C9.1 17.78,14.61 17.78,17.02 IC9.8 17.78,17.14 17.14,17.78 17.02,17.78 15.62,19.18 v15.62,23.24 | D1.1 16.64,99.06 14.61,99.06 14.1,99.57 6.1,99.57 5.08,98.55 C3.1 4.95,98.42 3.56,97.03 3.56,80.01 3.68,79.88 | 3.68,79.88 5.46,79.88 6.48,80.9 7.37,80.9 R1.1 | v14.1,24.77 7.87,24.77 0.64,32 0.64,76.83 3.68,79.88
VEE  (via drill 0.3)
  Top 0.127: v14.61,20.95 29.34,35.69 v29.34,60.71
  Bottom 0.127: R9.1 4.95,22.48 6.35,22.48 6.99,21.84 8.13,21.84 8.51,22.23 8.51,23.24 8.64,23.37 9.91,23.37 12.32,20.95 IC9.4 12.45,20.95 v14.61,20.95 | D2.2 16.76,103.89 24.51,103.89 24.89,103.5 C4.2 25.02,103.38 29.34,99.06 v29.34,60.71

### Text on the board
bPlace: -12V
bNames: 3.3V | SWDIO | SWCLK | GND